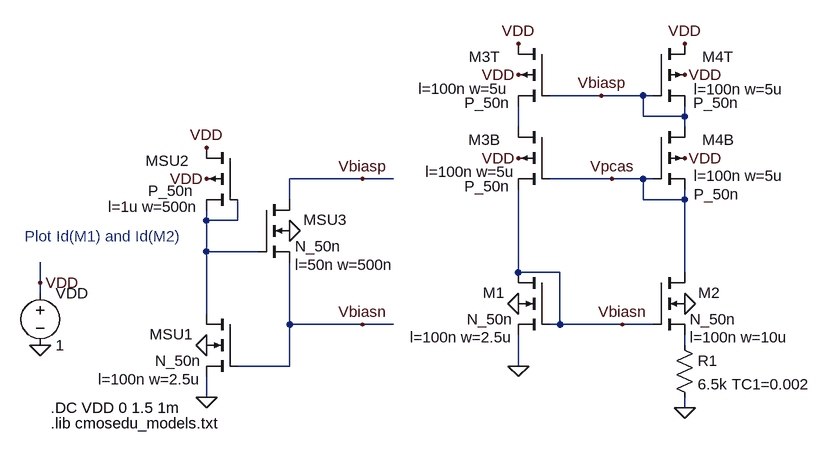
[diagram p0: schematic Fig23_10.asc]
Fig23_10.asc, the LTspice schematic file:
Version 4
SHEET 1 2344 680
WIRE 1136 -128 1136 -160
WIRE 1136 -112 1136 -128
WIRE 1392 -224 1392 -240
WIRE 1392 -176 1392 -224
WIRE 1392 -80 1392 -176
WIRE 1392 48 1392 16
WIRE 1440 -224 1392 -224
WIRE 1440 -224 1440 -256
WIRE 1472 -176 1392 -176
WIRE 1520 -256 1520 -288
WIRE 1520 -64 1520 -160
WIRE 1520 0 1440 0
WIRE 1520 0 1520 -64
WIRE 1632 -288 1520 -288
WIRE 1632 -64 1520 -64
WIRE 1680 -288 1632 -288
WIRE 1680 -64 1632 -64
WIRE 1872 -368 1872 -400
WIRE 1872 -144 1872 -272
WIRE 1872 0 1872 -48
WIRE 1936 -144 1872 -144
WIRE 1936 -64 1920 -64
WIRE 1936 -64 1936 -144
WIRE 2000 -416 1920 -416
WIRE 2016 -288 1920 -288
WIRE 2032 -64 1936 -64
WIRE 2064 -416 2000 -416
WIRE 2064 -384 2064 -416
WIRE 2064 -288 2016 -288
WIRE 2064 -256 2064 -288
WIRE 2080 -416 2064 -416
WIRE 2080 -288 2064 -288
WIRE 2080 -64 2032 -64
WIRE 2128 -384 2064 -384
WIRE 2128 -384 2128 -400
WIRE 2128 -368 2128 -384
WIRE 2128 -256 2064 -256
WIRE 2128 -256 2128 -272
WIRE 2128 -144 2128 -256
WIRE 2128 -32 2128 -48
WIRE 2128 64 2128 48
FLAG 1136 -32 0
FLAG 1136 -128 VDD
FLAG 1392 -32 0
FLAG 1392 48 0
FLAG 1520 -208 0
FLAG 1392 -288 VDD
FLAG 1392 -336 VDD
FLAG 1872 -448 VDD
FLAG 1872 -496 VDD
FLAG 1632 -288 Vbiasp
FLAG 1632 -64 Vbiasn
FLAG 1872 -320 VDD
FLAG 2128 -448 VDD
FLAG 2128 -496 VDD
FLAG 2128 -320 VDD
FLAG 2128 -96 0
FLAG 2128 64 0
FLAG 2000 -416 Vbiasp
FLAG 1872 -96 0
FLAG 1872 0 0
FLAG 2032 -64 Vbiasn
FLAG 2016 -288 Vpcas
SYMBOL voltage 1136 -128 R0
WINDOW 123 0 0 Left 0
WINDOW 39 0 0 Left 0
SYMATTR InstName VDD
SYMATTR Value 1
SYMBOL nmos4 1440 -80 M0
WINDOW 123 56 100 Left 0
WINDOW 0 69 31 Left 0
SYMATTR Value2 l=100n w=2.5u
SYMATTR InstName MSU1
SYMATTR Value N_50n
SYMBOL nmos4 1472 -256 R0
WINDOW 123 56 100 Left 0
WINDOW 0 69 31 Left 0
SYMATTR Value2 l=50n w=500n
SYMATTR InstName MSU3
SYMATTR Value N_50n
SYMBOL pmos4 1440 -336 M0
WINDOW 0 75 20 Left 0
WINDOW 3 61 91 Left 0
WINDOW 38 68 66 Left 0
SYMATTR InstName MSU2
SYMATTR Value l=1u w=500n
SYMATTR SpiceModel P_50n
SYMBOL pmos4 1920 -496 M0
WINDOW 0 75 20 Left 0
WINDOW 3 61 91 Left 0
WINDOW 123 63 69 Left 0
SYMATTR InstName M3T
SYMATTR Value P_50n
SYMATTR Value2 l=100n w=5u
SYMBOL pmos4 1920 -368 M0
WINDOW 0 75 20 Left 0
WINDOW 3 61 91 Left 0
WINDOW 123 52 69 Left 0
SYMATTR InstName M3B
SYMATTR Value P_50n
SYMATTR Value2 l=100n w=5u
SYMBOL pmos4 2080 -496 R0
WINDOW 0 75 20 Left 0
WINDOW 3 61 91 Left 0
WINDOW 123 62 70 Left 0
SYMATTR InstName M4T
SYMATTR Value P_50n
SYMATTR Value2 l=100n w=5u
SYMBOL pmos4 2080 -368 R0
WINDOW 0 75 20 Left 0
WINDOW 3 62 104 Left 0
WINDOW 123 62 75 Left 0
SYMATTR InstName M4B
SYMATTR Value P_50n
SYMATTR Value2 l=100n w=5u
SYMBOL nmos4 2080 -144 R0
WINDOW 123 56 100 Left 0
WINDOW 0 69 31 Left 0
SYMATTR Value2 l=100n w=10u
SYMATTR InstName M2
SYMATTR Value N_50n
SYMBOL nmos4 1920 -144 M0
WINDOW 123 56 100 Left 0
WINDOW 0 69 31 Left 0
SYMATTR Value2 l=100n w=2.5u
SYMATTR InstName M1
SYMATTR Value N_50n
SYMBOL res 2112 -48 R0
SYMATTR InstName R1
SYMATTR Value 6.5k TC1=0.002
TEXT 1152 88 Left 0 !.lib cmosedu_models.txt
TEXT 1112 -200 Left 0 ;Plot Id(M1) and Id(M2)
TEXT 1152 64 Left 0 !.DC VDD 0 1.5 1m

The netlist it stands for:
* Fig23_10.asc
VDD VDD 0 1
MSU1 N001 Vbiasn 0 0 N_50n l=100n w=2.5u
MSU3 Vbiasp N001 Vbiasn 0 N_50n l=50n w=500n
MSU2 VDD N001 N001 VDD P_50n l=1u w=500n
M3T VDD Vbiasp N002 VDD P_50n l=100n w=5u
M3B N002 Vpcas Vbiasn VDD P_50n l=100n w=5u
M4T VDD Vbiasp Vbiasp VDD P_50n l=100n w=5u
M4B Vbiasp Vpcas Vpcas VDD P_50n l=100n w=5u
M2 Vpcas Vbiasn N003 0 N_50n l=100n w=10u
M1 Vbiasn Vbiasn 0 0 N_50n l=100n w=2.5u
R1 N003 0 6.5k TC1=0.002
.model NMOS NMOS
.model PMOS PMOS
.lib standard.mos
.lib cmosedu_models.txt
* Plot Id(M1) and Id(M2)
.DC VDD 0 1.5 1m
.backanno
.end